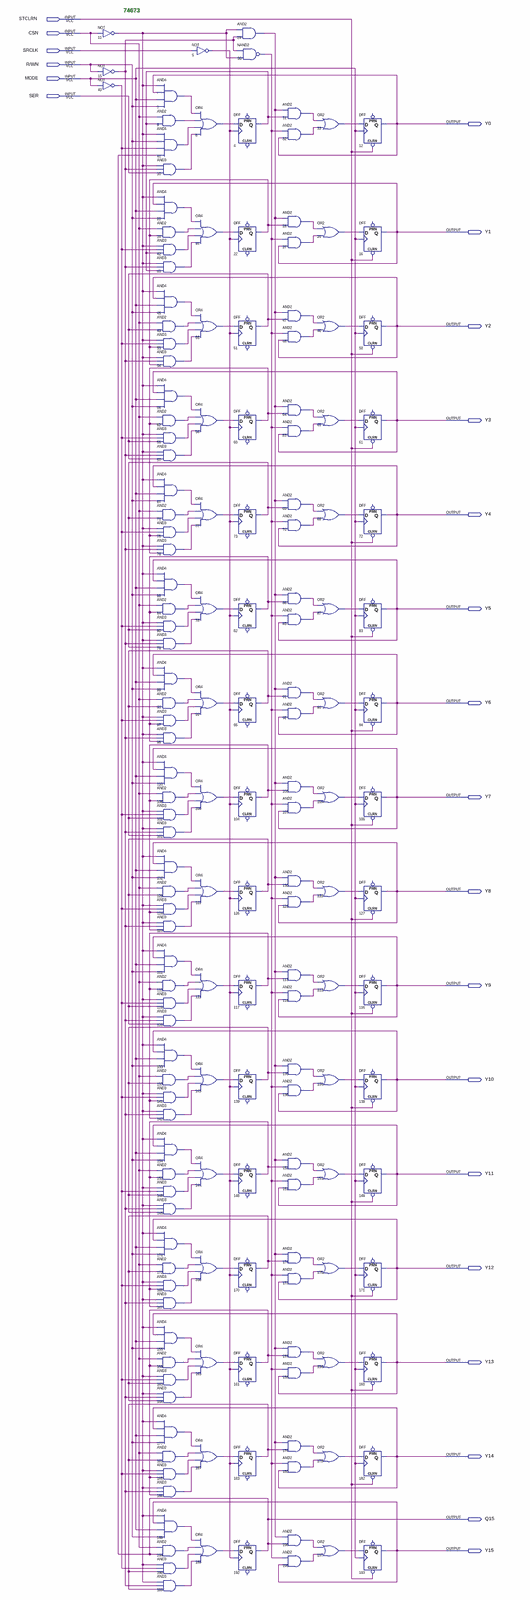
[diagram p0: schematic sheet, whole]
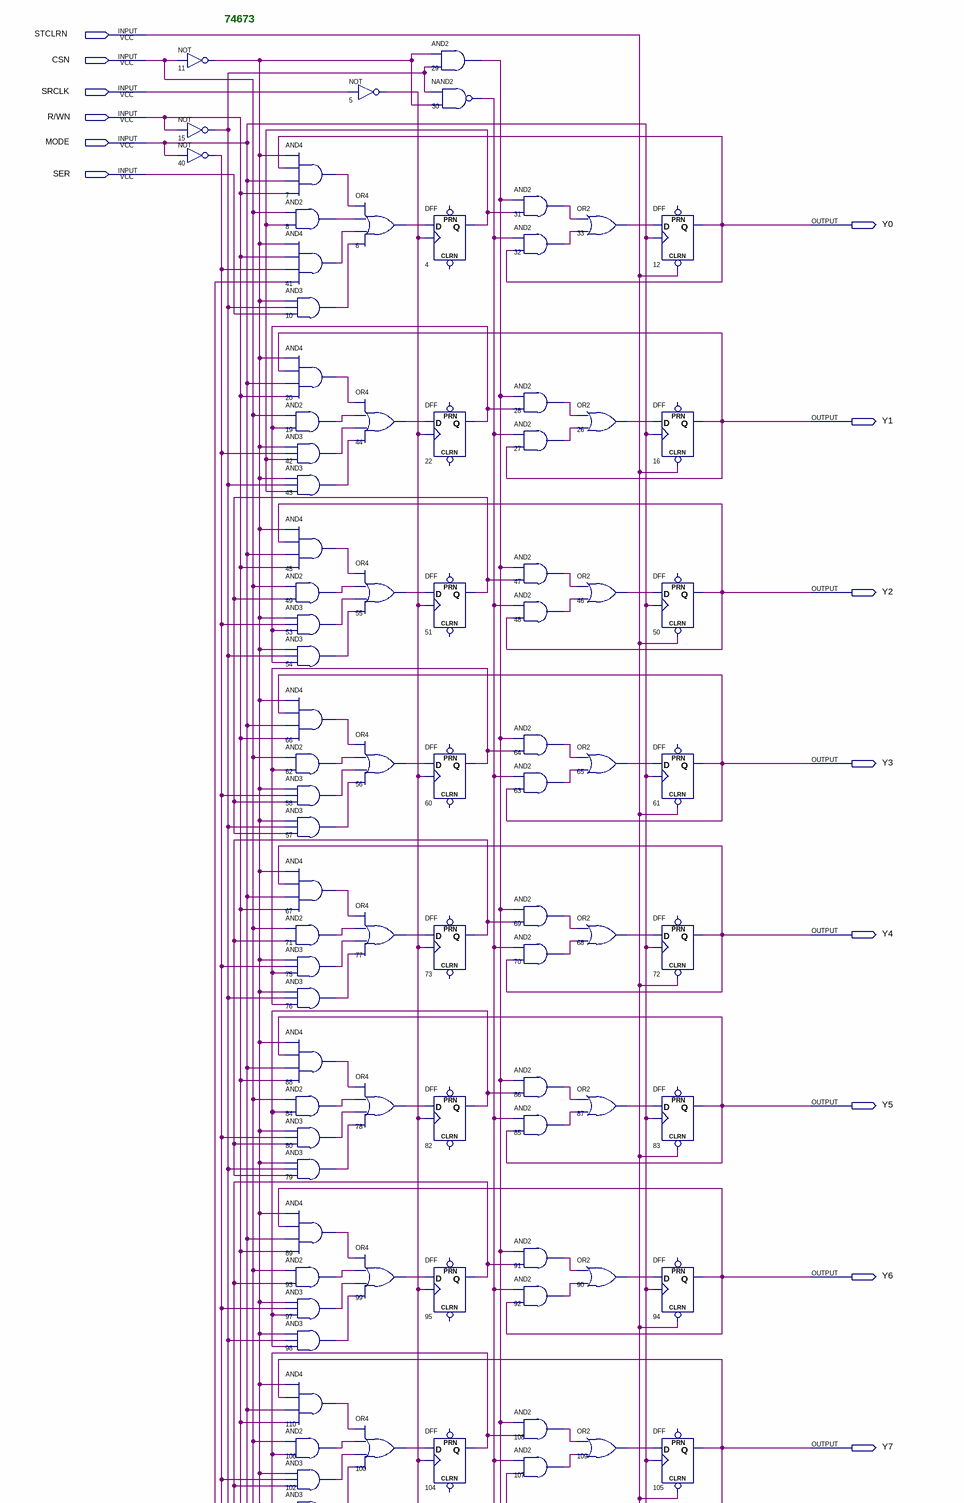
[diagram p1: schematic sheet, upper part]
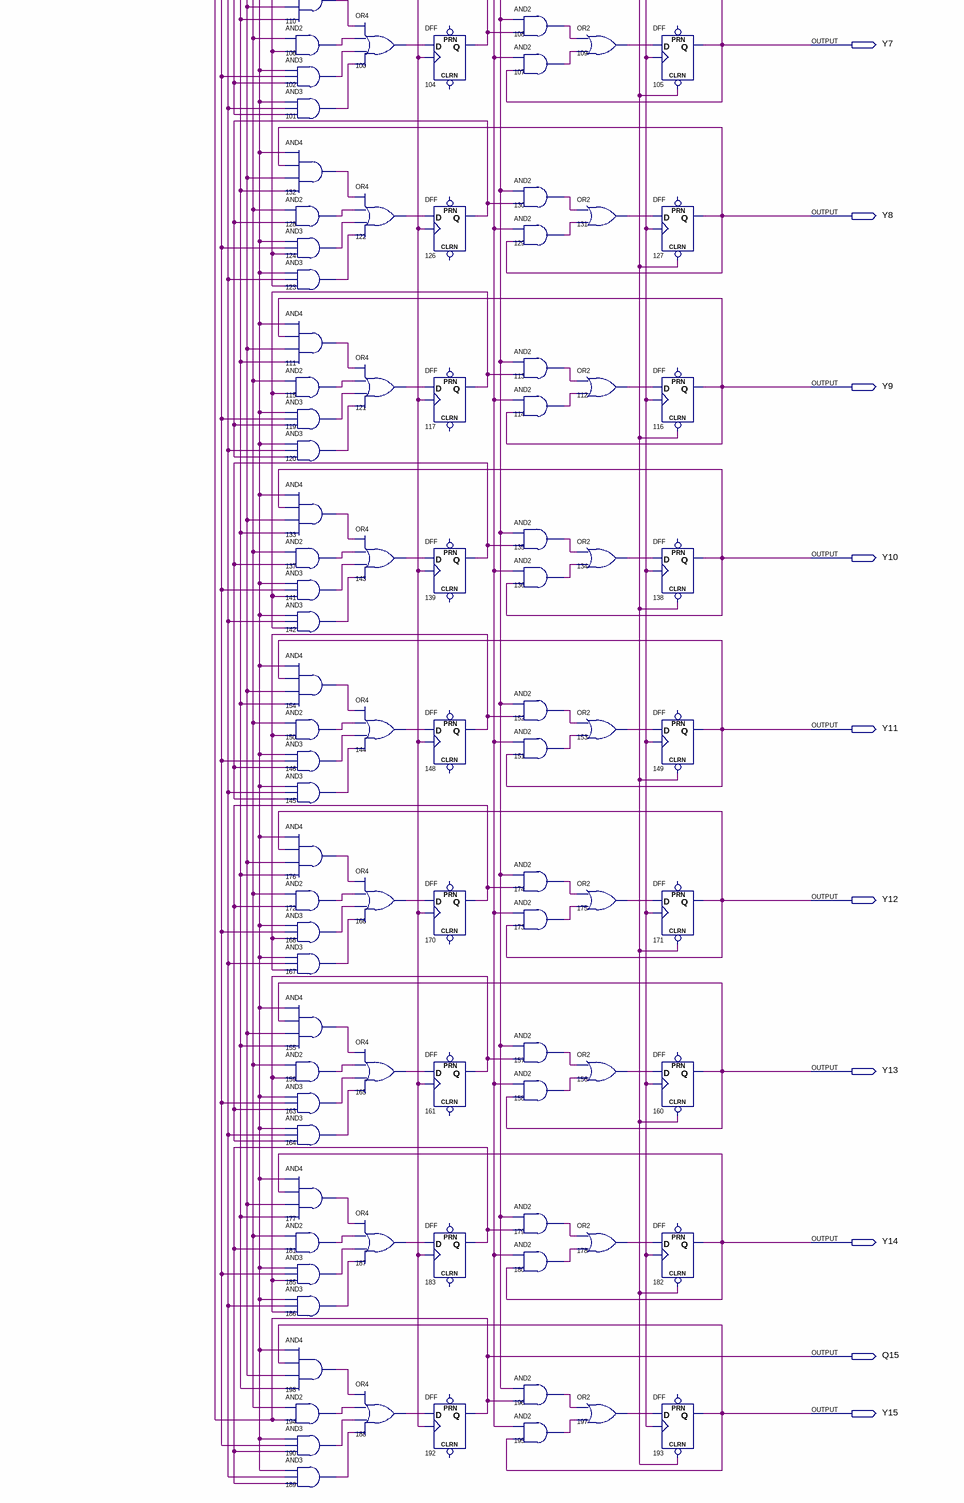
[diagram p2: schematic sheet, lower part]
// Quartus schematic 74673.bdf as structural Verilog: 166 symbols, 23 pins
module \74673  (
  input  STCLRN,
  input  CSN,
  input  SRCLK,
  input  \R/WN ,
  input  MODE,
  input  SER,
  output Y0,
  output Y1,
  output Y2,
  output Y3,
  output Y4,
  output Y5,
  output Y6,
  output Y7,
  output Y8,
  output Y9,
  output Y10,
  output Y11,
  output Y12,
  output Y13,
  output Y14,
  output Q15,
  output Y15
);

  wire n4_q, n5_out, n6_out, n7_out, n8_out, n10_out, n11_out, n15_out, n19_out, n20_out, n22_q, n26_out,
       n27_out, n28_out, n29_out, n30_out, n31_out, n32_out, n33_out, n40_out, n41_out, n42_out, n43_out,
       n44_out, n45_out, n46_out, n47_out, n48_out, n49_out, n51_q, n53_out, n54_out, n55_out, n56_out,
       n57_out, n58_out, n60_q, n62_out, n63_out, n64_out, n65_out, n66_out, n67_out, n68_out, n69_out,
       n70_out, n71_out, n73_q, n75_out, n76_out, n77_out, n78_out, n79_out, n80_out, n82_q, n84_out,
       n85_out, n86_out, n87_out, n88_out, n89_out, n90_out, n91_out, n92_out, n93_out, n95_q, n97_out,
       n98_out, n99_out, n100_out, n101_out, n102_out, n104_q, n106_out, n107_out, n108_out, n109_out,
       n110_out, n111_out, n112_out, n113_out, n114_out, n115_out, n117_q, n119_out, n120_out, n121_out,
       n122_out, n123_out, n124_out, n126_q, n128_out, n129_out, n130_out, n131_out, n132_out, n133_out,
       n134_out, n135_out, n136_out, n137_out, n139_q, n141_out, n142_out, n143_out, n144_out, n145_out,
       n146_out, n148_q, n150_out, n151_out, n152_out, n153_out, n154_out, n155_out, n156_out, n157_out,
       n158_out, n159_out, n161_q, n163_out, n164_out, n165_out, n166_out, n167_out, n168_out, n170_q,
       n172_out, n173_out, n174_out, n175_out, n176_out, n177_out, n178_out, n179_out, n180_out, n181_out,
       n183_q, n185_out, n186_out, n187_out, n188_out, n189_out, n190_out, n194_out, n195_out, n196_out,
       n197_out, n198_out;

  not u_11 (n11_out, CSN);
  not u_15 (n15_out, \R/WN );
  not u_40 (n40_out, MODE);
  and u_7 (n7_out, n11_out, Y0, MODE, \R/WN );
  and u_8 (n8_out, CSN, n4_q);
  and u_41 (n41_out, n11_out, \R/WN , n40_out, Q15);
  and u_10 (n10_out, n11_out, n15_out, SER);
  and u_20 (n20_out, n11_out, Y1, MODE, \R/WN );
  and u_19 (n19_out, CSN, n22_q);
  and u_42 (n42_out, n11_out, n40_out, n4_q);
  and u_43 (n43_out, n11_out, n15_out, n4_q);
  and u_45 (n45_out, n11_out, Y2, MODE, \R/WN );
  and u_49 (n49_out, CSN, n51_q);
  and u_53 (n53_out, n11_out, n40_out, n22_q);
  and u_54 (n54_out, n11_out, n15_out, n22_q);
  and u_66 (n66_out, n11_out, Y3, MODE, \R/WN );
  and u_62 (n62_out, CSN, n60_q);
  and u_58 (n58_out, n11_out, n40_out, n51_q);
  and u_57 (n57_out, n11_out, n15_out, n51_q);
  and u_67 (n67_out, n11_out, Y4, MODE, \R/WN );
  and u_71 (n71_out, CSN, n73_q);
  and u_75 (n75_out, n11_out, n40_out, n60_q);
  and u_76 (n76_out, n11_out, n15_out, n60_q);
  and u_88 (n88_out, n11_out, Y5, MODE, \R/WN );
  and u_84 (n84_out, CSN, n82_q);
  and u_80 (n80_out, n11_out, n40_out, n73_q);
  and u_79 (n79_out, n11_out, n15_out, n73_q);
  and u_89 (n89_out, n11_out, Y6, MODE, \R/WN );
  and u_93 (n93_out, CSN, n95_q);
  and u_97 (n97_out, n11_out, n40_out, n82_q);
  and u_98 (n98_out, n11_out, n15_out, n82_q);
  and u_110 (n110_out, n11_out, Y7, MODE, \R/WN );
  and u_106 (n106_out, CSN, n104_q);
  and u_102 (n102_out, n11_out, n40_out, n95_q);
  and u_101 (n101_out, n11_out, n15_out, n95_q);
  and u_132 (n132_out, n11_out, Y8, MODE, \R/WN );
  and u_128 (n128_out, CSN, n126_q);
  and u_124 (n124_out, n11_out, n40_out, n104_q);
  and u_123 (n123_out, n11_out, n15_out, n104_q);
  and u_111 (n111_out, n11_out, Y9, MODE, \R/WN );
  and u_115 (n115_out, CSN, n117_q);
  and u_119 (n119_out, n11_out, n40_out, n126_q);
  and u_120 (n120_out, n11_out, n15_out, n126_q);
  and u_133 (n133_out, n11_out, Y10, MODE, \R/WN );
  and u_137 (n137_out, CSN, n139_q);
  and u_141 (n141_out, n11_out, n40_out, n117_q);
  and u_142 (n142_out, n11_out, n15_out, n117_q);
  and u_154 (n154_out, n11_out, Y11, MODE, \R/WN );
  and u_150 (n150_out, CSN, n148_q);
  and u_146 (n146_out, n11_out, n40_out, n139_q);
  and u_145 (n145_out, n11_out, n15_out, n139_q);
  and u_176 (n176_out, n11_out, Y12, MODE, \R/WN );
  and u_172 (n172_out, CSN, n170_q);
  and u_168 (n168_out, n11_out, n40_out, n148_q);
  and u_167 (n167_out, n11_out, n15_out, n148_q);
  and u_155 (n155_out, n11_out, Y13, MODE, \R/WN );
  and u_159 (n159_out, CSN, n161_q);
  and u_163 (n163_out, n11_out, n40_out, n170_q);
  and u_164 (n164_out, n11_out, n15_out, n170_q);
  and u_177 (n177_out, n11_out, Y14, MODE, \R/WN );
  and u_181 (n181_out, CSN, n183_q);
  and u_185 (n185_out, n11_out, n40_out, n161_q);
  and u_186 (n186_out, n11_out, n15_out, n161_q);
  and u_198 (n198_out, n11_out, Y15, MODE, \R/WN );
  and u_194 (n194_out, CSN, Q15);
  and u_190 (n190_out, n11_out, n40_out, n183_q);
  and u_189 (n189_out, n11_out, n15_out, n183_q);
  not u_5 (n5_out, SRCLK);
  or u_6 (n6_out, n7_out, n8_out, n41_out, n10_out);
  or u_44 (n44_out, n20_out, n19_out, n42_out, n43_out);
  or u_55 (n55_out, n45_out, n49_out, n53_out, n54_out);
  or u_56 (n56_out, n66_out, n62_out, n58_out, n57_out);
  or u_77 (n77_out, n67_out, n71_out, n75_out, n76_out);
  or u_78 (n78_out, n88_out, n84_out, n80_out, n79_out);
  or u_99 (n99_out, n89_out, n93_out, n97_out, n98_out);
  or u_100 (n100_out, n110_out, n106_out, n102_out, n101_out);
  or u_122 (n122_out, n132_out, n128_out, n124_out, n123_out);
  or u_121 (n121_out, n111_out, n115_out, n119_out, n120_out);
  or u_143 (n143_out, n133_out, n137_out, n141_out, n142_out);
  or u_144 (n144_out, n154_out, n150_out, n146_out, n145_out);
  or u_166 (n166_out, n176_out, n172_out, n168_out, n167_out);
  or u_165 (n165_out, n155_out, n159_out, n163_out, n164_out);
  or u_187 (n187_out, n177_out, n181_out, n185_out, n186_out);
  or u_188 (n188_out, n198_out, n194_out, n190_out, n189_out);
  and u_29 (n29_out, n11_out, n15_out);
  nand u_30 (n30_out, n15_out, n11_out);
  DFF u_4 (.CLK(n5_out), .D(n6_out), .Q(n4_q));  // open: CLRN, PRN
  DFF u_22 (.CLK(n5_out), .D(n44_out), .Q(n22_q));  // open: CLRN, PRN
  DFF u_51 (.CLK(n5_out), .D(n55_out), .Q(n51_q));  // open: CLRN, PRN
  DFF u_60 (.CLK(n5_out), .D(n56_out), .Q(n60_q));  // open: CLRN, PRN
  DFF u_73 (.CLK(n5_out), .D(n77_out), .Q(n73_q));  // open: CLRN, PRN
  DFF u_82 (.CLK(n5_out), .D(n78_out), .Q(n82_q));  // open: CLRN, PRN
  DFF u_95 (.CLK(n5_out), .D(n99_out), .Q(n95_q));  // open: CLRN, PRN
  DFF u_104 (.CLK(n5_out), .D(n100_out), .Q(n104_q));  // open: CLRN, PRN
  DFF u_126 (.CLK(n5_out), .D(n122_out), .Q(n126_q));  // open: CLRN, PRN
  DFF u_117 (.CLK(n5_out), .D(n121_out), .Q(n117_q));  // open: CLRN, PRN
  DFF u_139 (.CLK(n5_out), .D(n143_out), .Q(n139_q));  // open: CLRN, PRN
  DFF u_148 (.CLK(n5_out), .D(n144_out), .Q(n148_q));  // open: CLRN, PRN
  DFF u_170 (.CLK(n5_out), .D(n166_out), .Q(n170_q));  // open: CLRN, PRN
  DFF u_161 (.CLK(n5_out), .D(n165_out), .Q(n161_q));  // open: CLRN, PRN
  DFF u_183 (.CLK(n5_out), .D(n187_out), .Q(n183_q));  // open: CLRN, PRN
  DFF u_192 (.CLK(n5_out), .D(n188_out), .Q(Q15));  // open: CLRN, PRN
  and u_31 (n31_out, n29_out, n4_q);
  and u_32 (n32_out, n30_out, Y0);
  and u_28 (n28_out, n29_out, n22_q);
  and u_27 (n27_out, n30_out, Y1);
  and u_47 (n47_out, n29_out, n51_q);
  and u_48 (n48_out, n30_out, Y2);
  and u_64 (n64_out, n29_out, n60_q);
  and u_63 (n63_out, n30_out, Y3);
  and u_69 (n69_out, n29_out, n73_q);
  and u_70 (n70_out, n30_out, Y4);
  and u_86 (n86_out, n29_out, n82_q);
  and u_85 (n85_out, n30_out, Y5);
  and u_91 (n91_out, n29_out, n95_q);
  and u_92 (n92_out, n30_out, Y6);
  and u_108 (n108_out, n29_out, n104_q);
  and u_107 (n107_out, n30_out, Y7);
  and u_130 (n130_out, n29_out, n126_q);
  and u_129 (n129_out, n30_out, Y8);
  and u_113 (n113_out, n29_out, n117_q);
  and u_114 (n114_out, n30_out, Y9);
  and u_135 (n135_out, n29_out, n139_q);
  and u_136 (n136_out, n30_out, Y10);
  and u_152 (n152_out, n29_out, n148_q);
  and u_151 (n151_out, n30_out, Y11);
  and u_174 (n174_out, n29_out, n170_q);
  and u_173 (n173_out, n30_out, Y12);
  and u_157 (n157_out, n29_out, n161_q);
  and u_158 (n158_out, n30_out, Y13);
  and u_179 (n179_out, n29_out, n183_q);
  and u_180 (n180_out, n30_out, Y14);
  and u_196 (n196_out, n29_out, Q15);
  and u_195 (n195_out, n30_out, Y15);
  or u_33 (n33_out, n31_out, n32_out);
  or u_26 (n26_out, n28_out, n27_out);
  or u_46 (n46_out, n47_out, n48_out);
  or u_65 (n65_out, n64_out, n63_out);
  or u_68 (n68_out, n69_out, n70_out);
  or u_87 (n87_out, n86_out, n85_out);
  or u_90 (n90_out, n91_out, n92_out);
  or u_109 (n109_out, n108_out, n107_out);
  or u_131 (n131_out, n130_out, n129_out);
  or u_112 (n112_out, n113_out, n114_out);
  or u_134 (n134_out, n135_out, n136_out);
  or u_153 (n153_out, n152_out, n151_out);
  or u_175 (n175_out, n174_out, n173_out);
  or u_156 (n156_out, n157_out, n158_out);
  or u_178 (n178_out, n179_out, n180_out);
  or u_197 (n197_out, n196_out, n195_out);
  DFF u_12 (.CLRN(STCLRN), .CLK(MODE), .D(n33_out), .Q(Y0));  // open: PRN
  DFF u_16 (.CLRN(STCLRN), .CLK(MODE), .D(n26_out), .Q(Y1));  // open: PRN
  DFF u_50 (.CLRN(STCLRN), .CLK(MODE), .D(n46_out), .Q(Y2));  // open: PRN
  DFF u_61 (.CLRN(STCLRN), .CLK(MODE), .D(n65_out), .Q(Y3));  // open: PRN
  DFF u_72 (.CLRN(STCLRN), .CLK(MODE), .D(n68_out), .Q(Y4));  // open: PRN
  DFF u_83 (.CLRN(STCLRN), .CLK(MODE), .D(n87_out), .Q(Y5));  // open: PRN
  DFF u_94 (.CLRN(STCLRN), .CLK(MODE), .D(n90_out), .Q(Y6));  // open: PRN
  DFF u_105 (.CLRN(STCLRN), .CLK(MODE), .D(n109_out), .Q(Y7));  // open: PRN
  DFF u_127 (.CLRN(STCLRN), .CLK(MODE), .D(n131_out), .Q(Y8));  // open: PRN
  DFF u_116 (.CLRN(STCLRN), .CLK(MODE), .D(n112_out), .Q(Y9));  // open: PRN
  DFF u_138 (.CLRN(STCLRN), .CLK(MODE), .D(n134_out), .Q(Y10));  // open: PRN
  DFF u_149 (.CLRN(STCLRN), .CLK(MODE), .D(n153_out), .Q(Y11));  // open: PRN
  DFF u_171 (.CLRN(STCLRN), .CLK(MODE), .D(n175_out), .Q(Y12));  // open: PRN
  DFF u_160 (.CLRN(STCLRN), .CLK(MODE), .D(n156_out), .Q(Y13));  // open: PRN
  DFF u_182 (.CLRN(STCLRN), .CLK(MODE), .D(n178_out), .Q(Y14));  // open: PRN
  DFF u_193 (.CLRN(STCLRN), .CLK(MODE), .D(n197_out), .Q(Y15));  // open: PRN

  // Notes on the sheet:
  //   74673
endmodule
